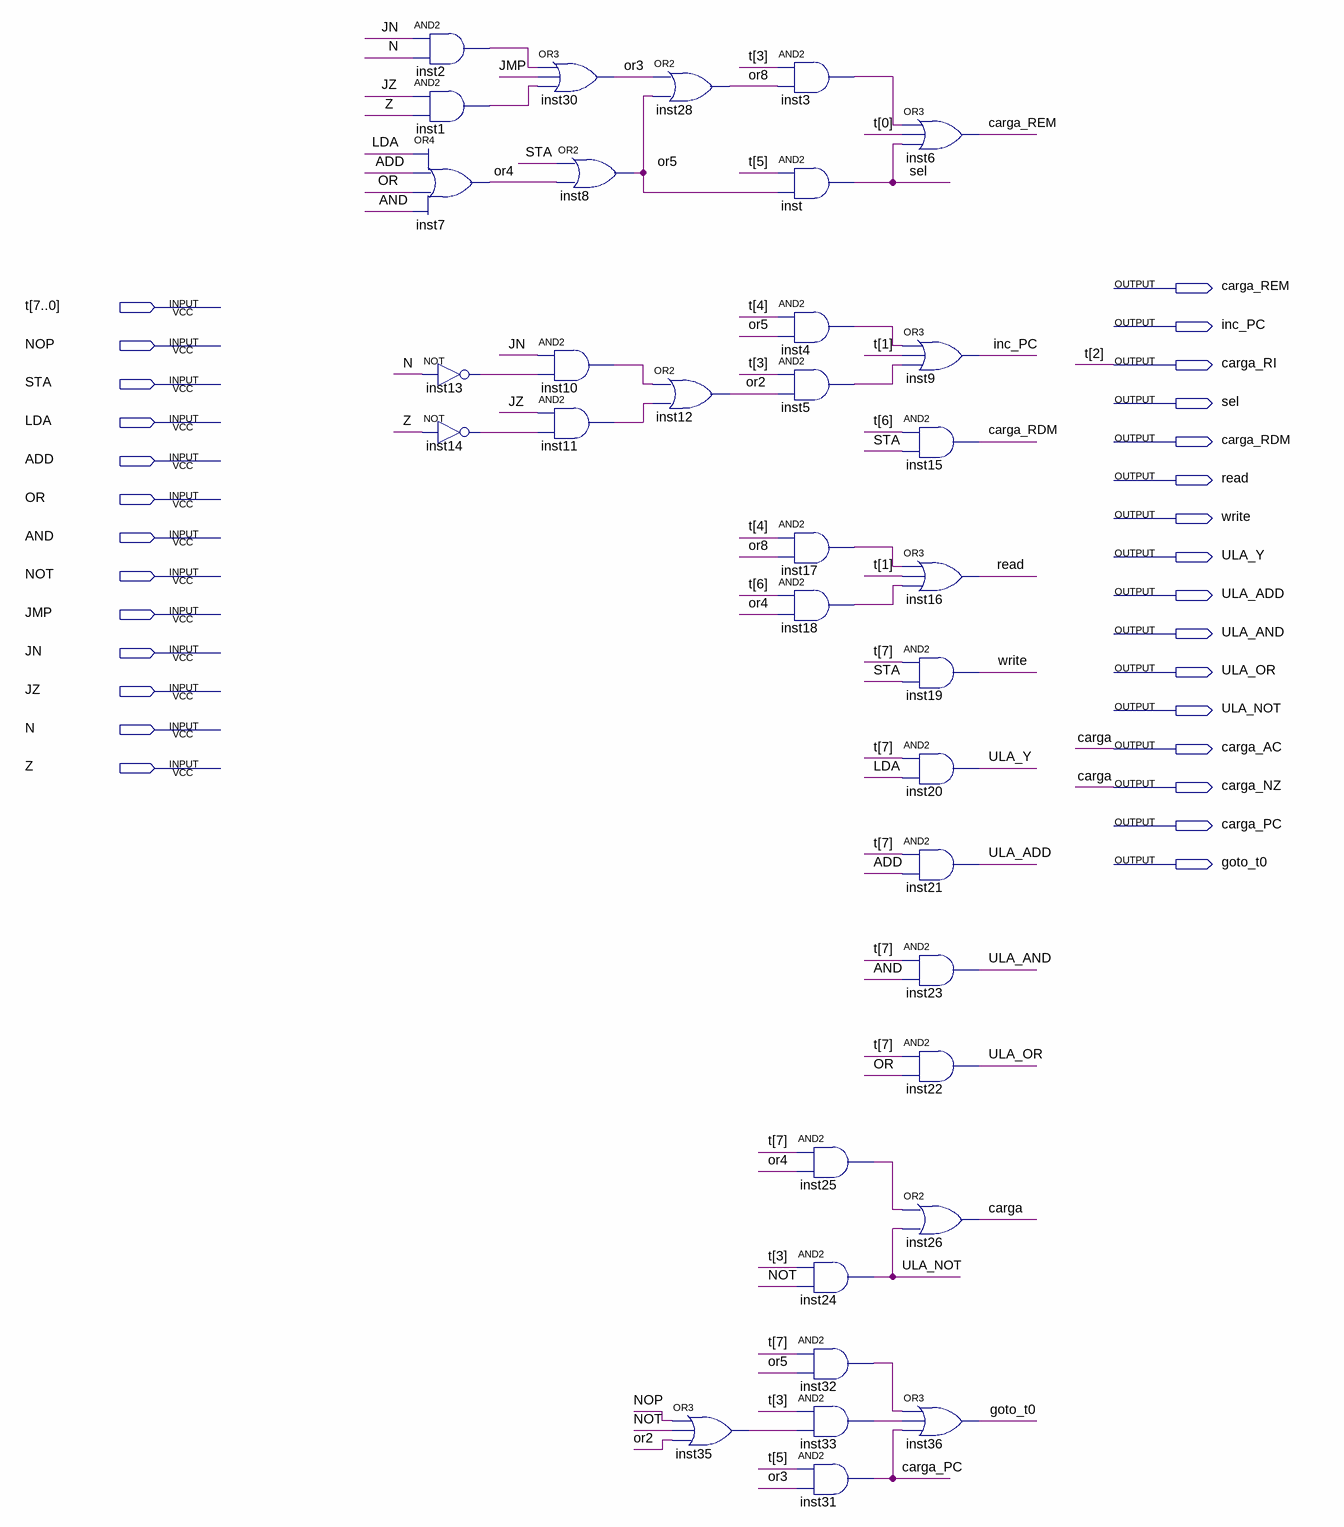
[diagram p0: schematic sheet]
// Quartus schematic control.bdf as structural Verilog: 34 symbols, 29 pins
module control (
  input  [7:0] t,
  input  NOP,
  input  STA,
  input  LDA,
  input  ADD,
  input  OR,
  input  AND,
  input  NOT,
  input  JMP,
  input  JN,
  input  JZ,
  input  N,
  input  Z,
  output carga_REM,
  output inc_PC,
  output carga_RI,
  output sel,
  output carga_RDM,
  output read,
  output write,
  output ULA_Y,
  output ULA_ADD,
  output ULA_AND,
  output ULA_OR,
  output ULA_NOT,
  output carga_AC,
  output carga_NZ,
  output carga_PC,
  output goto_t0
);

  wire inst1_out, inst2_out, inst3_out, inst4_out, inst5_out, inst10_out, inst11_out, inst13_out, inst14_out,
       inst17_out, inst18_out, inst25_out, inst32_out, inst33_out, inst35_out, or2, or3, or4, or5, or8;

  and inst2 (inst2_out, JN, N);
  and inst1 (inst1_out, JZ, Z);
  or inst7 (or4, LDA, ADD, OR, AND);
  not inst13 (inst13_out, N);
  not inst14 (inst14_out, Z);
  or inst30 (or3, inst2_out, JMP, inst1_out);
  and inst10 (inst10_out, JN, inst13_out);
  and inst11 (inst11_out, JZ, inst14_out);
  or inst8 (or5, STA, or4);
  or inst28 (or8, or3, or5);
  or inst12 (or2, inst10_out, inst11_out);
  or inst35 (inst35_out, NOP, NOT, or2);
  and inst3 (inst3_out, t[3], or8);
  and inst (sel, t[5], or5);
  and inst4 (inst4_out, t[4], or5);
  and inst5 (inst5_out, t[3], or2);
  and inst17 (inst17_out, t[4], or8);
  and inst18 (inst18_out, t[6], or4);
  and inst25 (inst25_out, t[7], or4);
  and inst24 (ULA_NOT, t[3], NOT);
  and inst32 (inst32_out, t[7], or5);
  and inst33 (inst33_out, t[3], inst35_out);
  and inst31 (carga_PC, t[5], or3);
  or inst6 (carga_REM, inst3_out, t[0], sel);
  or inst9 (inc_PC, inst4_out, t[1], inst5_out);
  and inst15 (carga_RDM, t[6], STA);
  or inst16 (read, inst17_out, t[1], inst18_out);
  and inst19 (write, t[7], STA);
  and inst20 (ULA_Y, t[7], LDA);
  and inst21 (ULA_ADD, t[7], ADD);
  and inst23 (ULA_AND, t[7], AND);
  and inst22 (ULA_OR, t[7], OR);
  or inst26 (carga_AC, inst25_out, ULA_NOT);
  or inst36 (goto_t0, inst32_out, inst33_out, carga_PC);

  assign carga_NZ = carga_AC;
  assign carga_RI = t[2];

  // Other names for the same wires on the sheet: carga = carga_AC
endmodule
